# EAGLE design MMA7660-v10 (EAGLE 6.2)
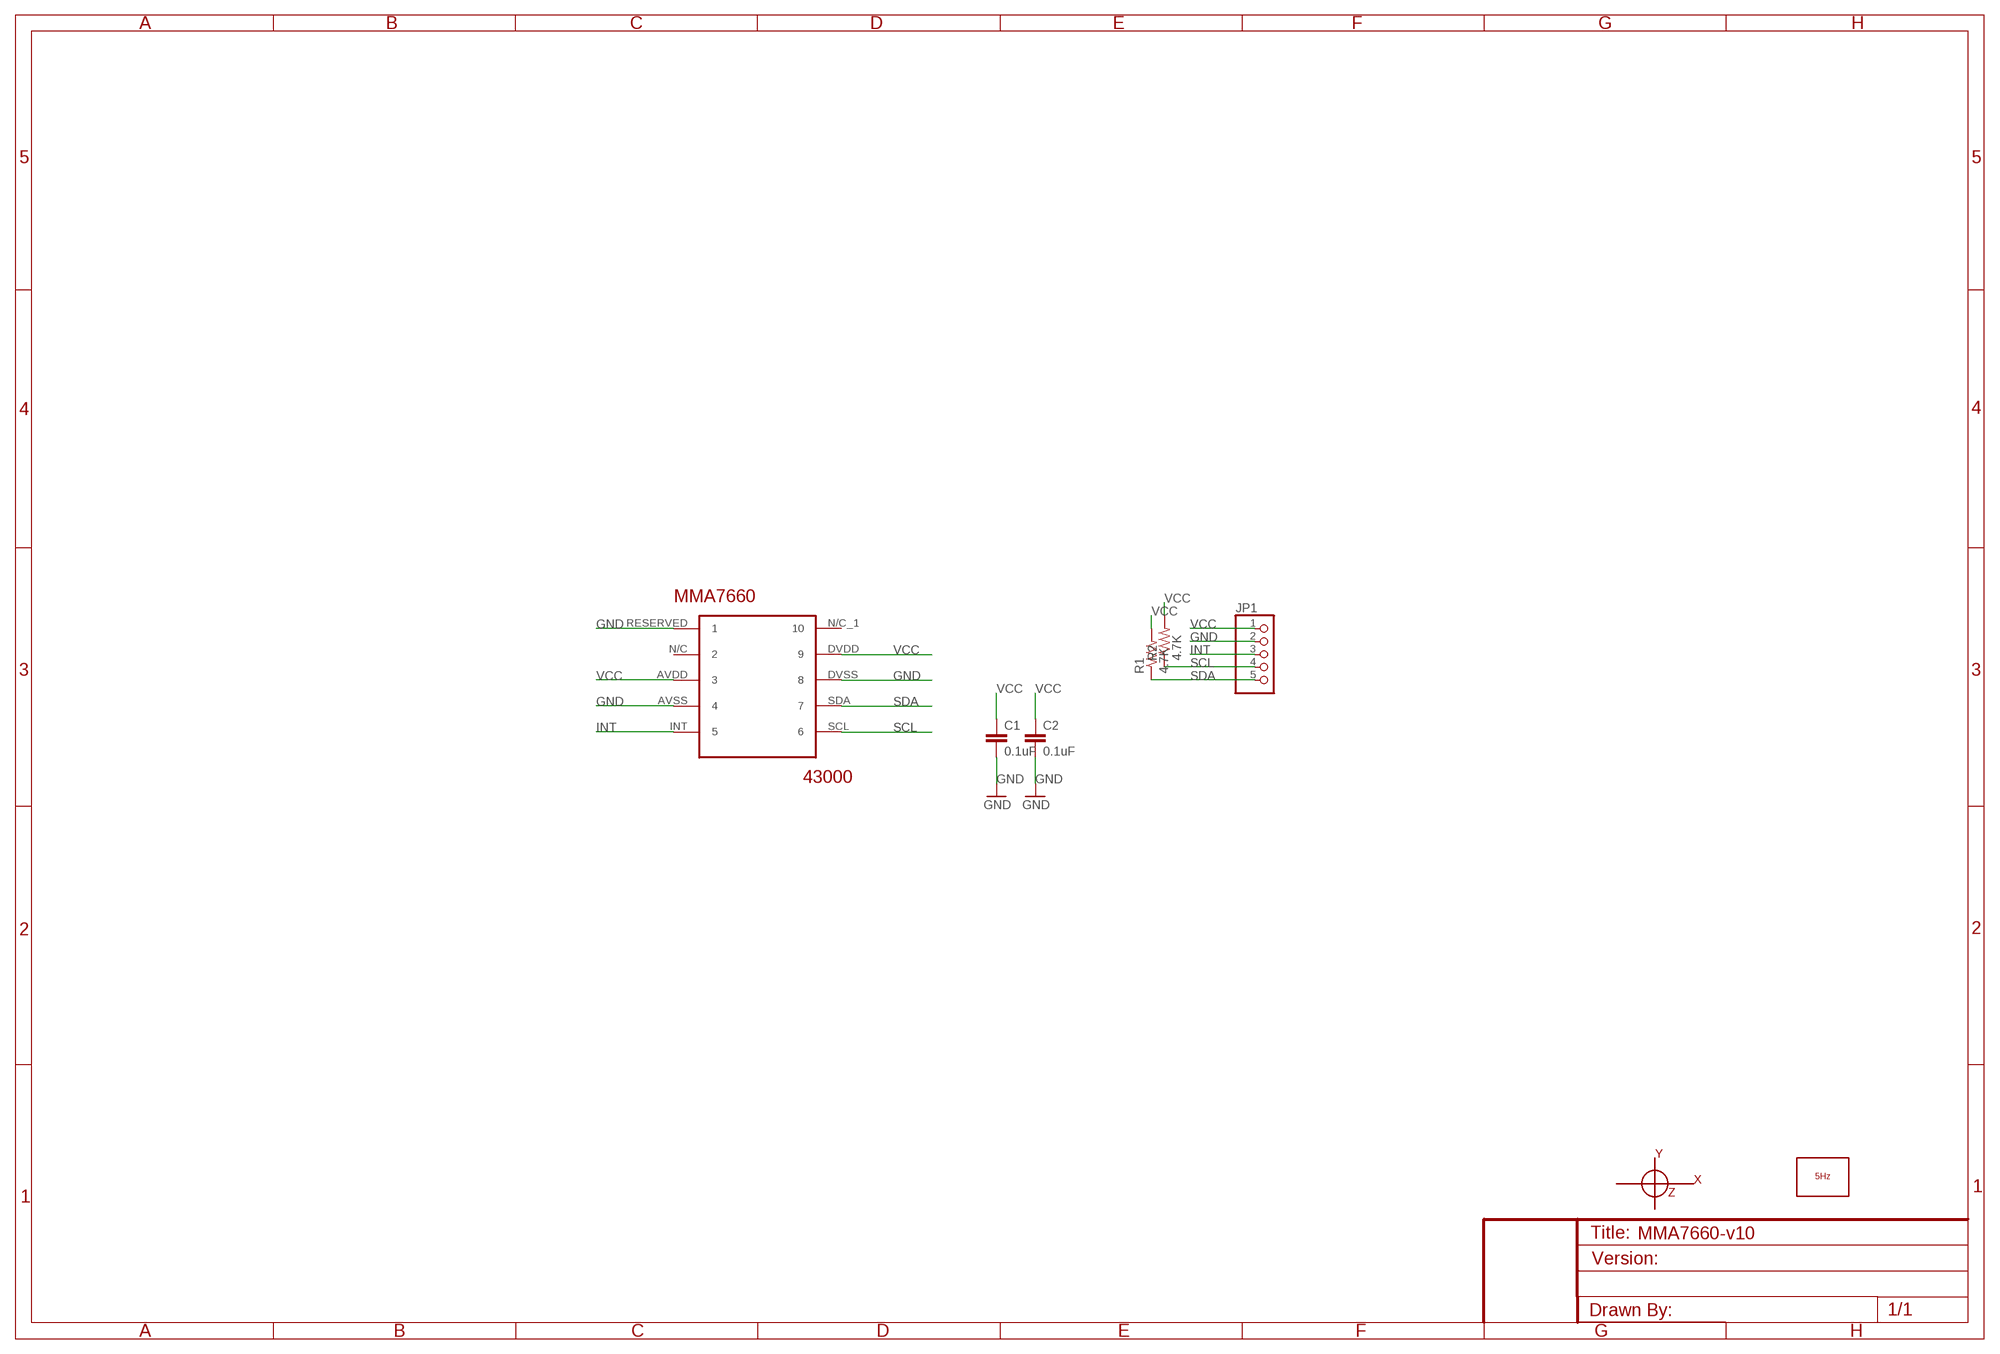
[diagram p0: schematic, sheet 1]

## Parts
C1  0.1uF  CAP0603-CAP  [0603-CAP]
C2  0.1uF  CAP0603-CAP  [0603-CAP]
JP1  PINHD-1X5  [1X05]
LOGO1  LOGO_5HZ_H_5MM  [5HZ_LOGO_H_5MM]
MMA7660  43000  MMA7660FC  [MMA7660FC]
R1  4.7K  RESISTORPTH-1/6W  [1/6W-RES]
R2  4.7K  RESISTORPTH-1/6W  [1/6W-RES]
U$4  EJES_CARTESIANO_5MM  [EJE_CARTESIANO_5MM]

## Nets
GND: C1.2 C2.2 JP1.2 MMA7660.AVSS MMA7660.DVSS MMA7660.RESERVED
INT: JP1.3 MMA7660.INT
SCL: JP1.4 MMA7660.SCL R2.1
SDA: JP1.5 MMA7660.SDA R1.1
VCC: C1.1 C2.1 JP1.1 MMA7660.AVDD MMA7660.DVDD R1.2 R2.2
Unconnected: MMA7660.N/C MMA7660.N/C_1

## Library data of the parts
C1 C2 = SparkFun:CAP: Capacitor Standard 0603 ceramic capacitor, and 0.1" leaded capacitor.
JP1 = pinhead:PINHD-1X5: PIN HEADER
LOGO1 = 5hz-electronica:LOGO_5HZ: Logotipo 5Hz "según Pedro"
MMA7660 = accelerometer:MMA7660FC
R1 R2 = SparkFun:RESISTOR: Resistor Basic schematic elements and footprints for 0603, 1206, and PTH resistors.
U$4 = PEDRO:EJES

## Board
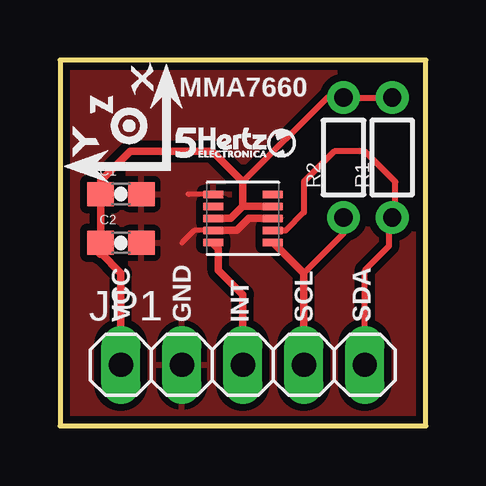
[diagram p1: board, top side]
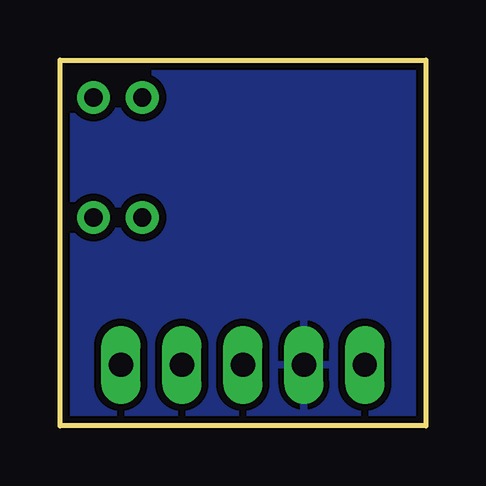
[diagram p2: board, bottom side, seen from below]

Size 15.24 x 15.24 mm. Coordinates in mm from the lower left corner, seen from the top.
Outline: 0,0 15.24,0 15.24,15.24 0,15.24 0,0
Copper layers (1*16): Top 0.035mm / dielectric 1.5mm / Bottom 0.035mm
Design rules: minimum track width 8mil, minimum drill 20mil, track to track 8mil, track to pad 8mil, pad to pad 8mil, via to via 8mil, smd to smd 8mil, copper to edge 10mil, drill to drill 8mil, minimum pad ring 12mil, minimum via ring 10mil, stop-mask expansion 4mil, vias tented up to drill 25mil, thermal gap 10mil

### Footprints (pad centres in the part's own frame; a part is rotated, then mirrored left to right if it is on the bottom)
0603-CAP = smd 1.1 x 1: 1 -0.85,0; 2 0.85,0
1X05 = drill 1.016 long: 1 -5.08,0; 2 -2.54,0; 3 0,0; 4 2.54,0; 5 5.08,0
MMA7660FC = smd 0.825 x 0.3: AVDD -1.24,0; AVSS -1.24,-0.5; DVDD 1.24,0.5; DVSS 1.24,0; INT -1.24,-1; N/C -1.24,0.5; N/C_1 1.24,1; RESERVED -1.24,1; SCL 1.24,-1; SDA 1.24,-0.5
1/6W-RES = drill 0.762: 1 -2.5,0; 2 2.5,0

### Placement (x,y rotation side)
C1  2.54,9.65 0 top
C2  2.54,7.62 0 top
JP1  7.62,2.54 0 top
LOGO1  4.83,11.18 0 top
MMA7660  7.62,8.64 0 top
R1  13.84,11.18 90 top
R2  11.81,11.18 90 top
U$4  5.08,10.16 90 top

### Tracks (layer width: path | path; a pad name or v marks a point on that pad's centre or on a via)
GND
  Top 0.203: MMA7660.RESERVED 5.35,9.64 5.33,9.65 | MMA7660.AVSS 5.6,8.14 5.08,7.62
  Top 0.305: MMA7660.AVSS 7.37,8.14 7.87,8.64 MMA7660.DVSS
  pour Top (isolate 0.305): 0,15.24 15.24,15.24 15.24,0 0,0
  pour Bottom (isolate 0.305): 0,15.24 0,0 15.24,0 15.24,15.24
INT
  Top 0.254: 6.35,7.62 6.37,7.64 MMA7660.INT
  Top 0.305: JP1.3 7.62,5.46 6.6,6.48 6.6,7.37 6.35,7.62
SCL
  Top 0.254: 8.87,7.64 MMA7660.SCL | R2.1 11.81,8 10.16,6.35
  Top 0.305: JP1.4 10.16,6.35 8.87,7.64
SDA
  Top 0.254: MMA7660.SDA 9.01,8.14 9.02,8.13 9.4,8.13 10.16,8.89 10.16,10.16 11.43,11.43 12.7,11.43 13.97,10.16 13.97,8.8 R1.1 13.72,8.55 13.72,7.49 12.7,6.48 JP1.5
VCC
  Top 0.254: 8.76,9.14 8.77,9.14 MMA7660.DVDD | R1.2 R2.2 11.14,13.68 7.62,10.16
  Top 0.305: JP1.1 2.54,6.35 1.69,7.2 | 7.62,9.14 8.76,9.14 | MMA7660.AVDD 7.11,8.64 7.62,9.14 | C2.1 C1.1 1.69,10.2 2.92,11.43 6.35,11.43 7.62,10.16 7.62,9.14
  Top 0.406: 1.69,7.2 C2.1

### Text on the board
tPlace: MMA7660 | VCC | GND | INT | SCL | SDA